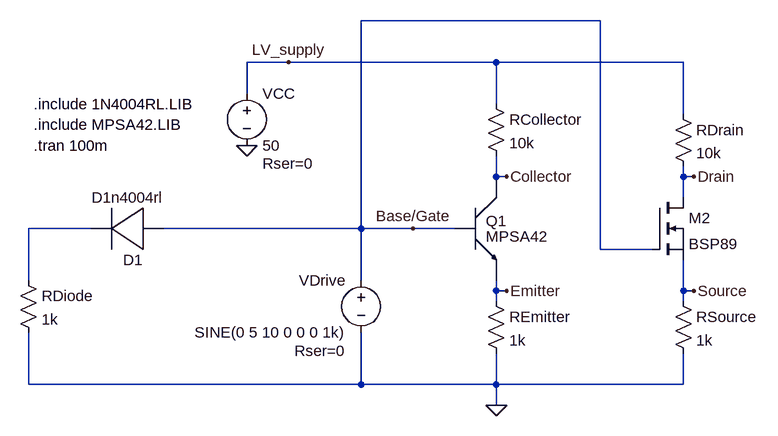
[diagram p0: schematic component_check.asc]
component_check.asc, the LTspice schematic file:
Version 4
SHEET 1 1288 680
WIRE 624 -176 256 -176
WIRE 144 -112 80 -112
WIRE 464 -112 144 -112
WIRE 752 -112 464 -112
WIRE 80 -64 80 -112
WIRE 464 -48 464 -112
WIRE 752 -32 752 -112
WIRE 464 64 464 32
WIRE 480 64 464 64
WIRE 752 64 752 48
WIRE 768 64 752 64
WIRE 464 96 464 64
WIRE 752 96 752 64
WIRE -160 144 -256 144
WIRE 256 144 256 -176
WIRE 256 144 -48 144
WIRE 336 144 256 144
WIRE 400 144 336 144
WIRE 624 176 624 -176
WIRE 704 176 624 176
WIRE -256 224 -256 144
WIRE 256 224 256 144
WIRE 464 240 464 224
WIRE 480 240 464 240
WIRE 752 240 752 192
WIRE 768 240 752 240
WIRE 464 256 464 240
WIRE 752 256 752 240
WIRE -256 384 -256 304
WIRE 256 384 256 304
WIRE 256 384 -256 384
WIRE 464 384 464 336
WIRE 464 384 256 384
WIRE 752 384 752 336
WIRE 752 384 464 384
WIRE 464 416 464 384
FLAG 464 416 0
FLAG 144 -112 LV_supply
FLAG 80 16 0
FLAG 336 144 Base/Gate
FLAG 480 64 Collector
FLAG 480 240 Emitter
FLAG 768 64 Drain
FLAG 768 240 Source
SYMBOL voltage 256 208 M0
WINDOW 123 0 0 Left 0
WINDOW 39 24 124 Left 2
SYMATTR SpiceLine Rser=0
SYMATTR InstName VDrive
SYMATTR Value SINE(0 5 10 0 0 0 1k)
SYMBOL MPSA42 432 144 R0
SYMATTR InstName Q1
SYMBOL voltage 80 -80 R0
WINDOW 123 0 0 Left 0
WINDOW 39 24 124 Left 2
SYMATTR SpiceLine Rser=0
SYMATTR InstName VCC
SYMATTR Value 50
SYMBOL res 448 240 R0
SYMATTR InstName REmitter
SYMATTR Value 1k
SYMBOL res -272 208 R0
SYMATTR InstName RDiode
SYMATTR Value 1k
SYMBOL 1N4004RL -80 144 R180
SYMATTR InstName D1
SYMBOL res 448 -64 R0
SYMATTR InstName RCollector
SYMATTR Value 10k
SYMBOL res 736 -48 R0
SYMATTR InstName RDrain
SYMATTR Value 10k
SYMBOL res 736 240 R0
SYMATTR InstName RSource
SYMATTR Value 1k
SYMBOL nmos 704 96 R0
SYMATTR InstName M2
SYMATTR Value BSP89
TEXT -248 16 Left 2 !.tran 100m
TEXT -248 -16 Left 2 !.include MPSA42.LIB
TEXT -248 -48 Left 2 !.include 1N4004RL.LIB

The netlist it stands for:
* component_check.asc
VDrive Base/Gate 0 SINE(0 5 10 0 0 0 1k) Rser=0
Q1 Collector Base/Gate Emitter 0 MPSA42
VCC LV_supply 0 50 Rser=0
REmitter Emitter 0 1k
RDiode N001 0 1k
D1 Base/Gate N001 D1n4004rl
RCollector LV_supply Collector 10k
RDrain LV_supply Drain 10k
RSource Source 0 1k
M2 Drain Base/Gate Source Source BSP89
.model D D
.lib standard.dio
.model NPN NPN
.model PNP PNP
.lib standard.bjt
.model NMOS NMOS
.model PMOS PMOS
.lib standard.mos
.tran 100m
.include MPSA42.LIB
.include 1N4004RL.LIB
.lib MPSA42.LIB
.lib 1N4004RL.LIB
.backanno
.end